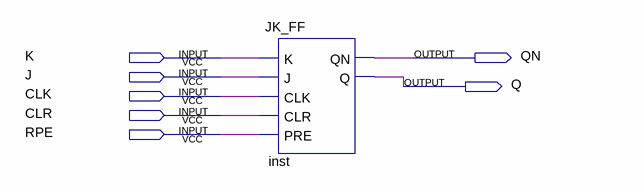
[diagram p0: schematic sheet]
// Quartus schematic lab13_3.bdf as structural Verilog: 1 symbols, 7 pins
module lab13_3 (
  input  K,
  input  J,
  input  CLK,
  input  CLR,
  input  RPE,
  output QN,
  output Q
);

  JK_FF inst (.K(K), .J(J), .CLK(CLK), .CLR(CLR), .PRE(RPE), .QN(QN), .Q(Q));
endmodule
